# Altium schematic sheet Flow_sensor.SchDoc
size 420 x 297 mm; Address1: Address1; Address2: Address2; Address3: Address3; Address4: Address4; DocumentNumber: *Э3; SheetNumber: 12; SheetTotal: 15; DocumentType: Схема электрическая *
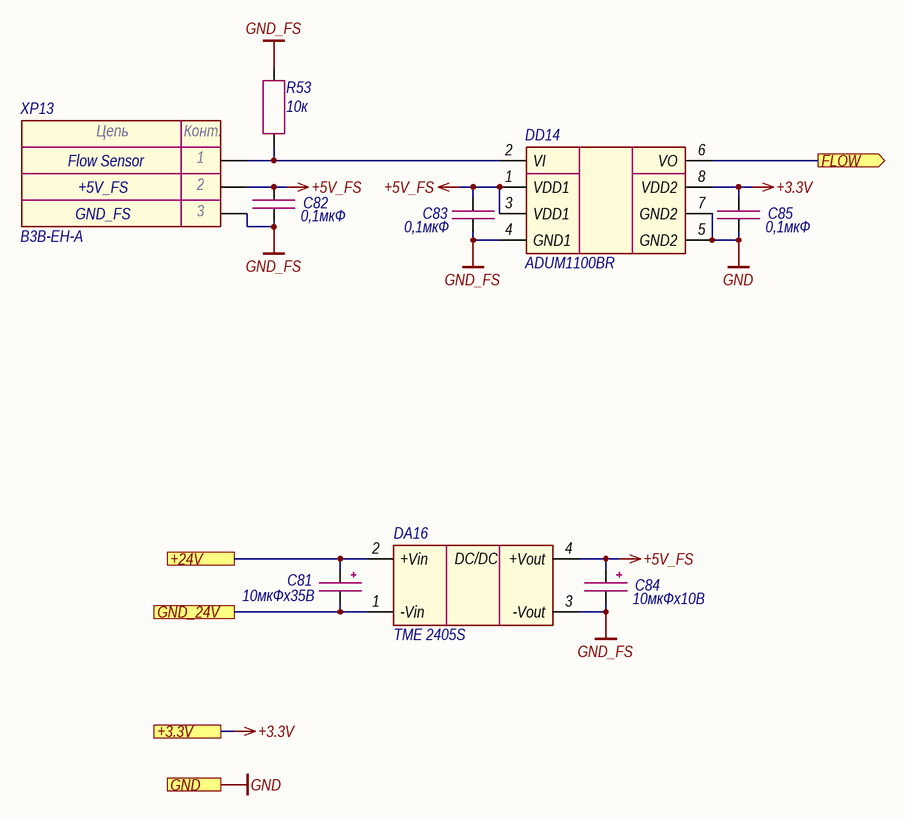
[diagram p0: Flow_sensor.SchDoc]

## Parts
C81  10мкФх35B  [CAP_C]
C82  0,1мкФ  [CAP_0603]
C83  0,1мкФ  [CAP_0603]
C84  10мкФх10B  [CAP_A]
C85  0,1мкФ  [CAP_0603]
DA16  TME 2405S  [TME (SIP-4)]
DD14  ADUM1100BR  [SOIC-8]
R53  10к  [RES_0603]
XP13  B3B-EH-A  [B3B-EH-A]

## Ports
+3.3V (see Main[1C], Button[1D], Ethernet[3D], Fiber_interlock[2C], Hardwiring[3D], LD_driver[1D], Power_supply[1D], Power_supply_CAN[1D], SF_driver[2C]), +24V (see Main[1C], Button[1C], Column[1C], Hardwiring[3C], Indication[1C], LD_driver[1C], Power_supply[1D], Power_supply_CAN[1D]), FLOW (out, see Main[1C]), GND (see Main[1C], Button[1D], Column[1C], Ethernet[3D], Fiber_interlock[2C], Guide_laser[1C], Hardwiring[3D], Indication[1C], LD_driver[1D], Power_supply[1D], Power_supply_CAN[1D], SF_driver[2D]), GND_24V (see Main[1C], Button[1D], Column[1C], Hardwiring[3C], Indication[1C], LD_driver[1D], Power_supply[1D], Power_supply_CAN[1D])

## Nets
+3.3V: C85.1 DD14.8(VDD2) ; port +3.3V
+5V_FS: C82.1 C83.1 C84.1 DA16.4(+Vout) DD14.1(VDD1) DD14.3(VDD1) XP13.2
GND: C85.2 DD14.5(GND2) DD14.7(GND2) ; port GND
GND_FS: C82.2 C83.2 C84.2 DA16.3(-Vout) DD14.4(GND1) R53.2 XP13.3
+24V: C81.1 DA16.2(+Vin) ; port +24V
FLOW: DD14.6(VO) ; port FLOW
GND_24V: C81.2 DA16.1(-Vin) ; port GND_24V
NetDD14_2: DD14.2(VI) R53.1 XP13.1

## Notes on the sheet
- +5V_FS
- Flow Sensor
- GND_FS
- Подп. и дата
- Инв. № дубл.
- Взам. инв. №
- Инв. № подл.
- Изм.
- Лист
- № докум.
- Подп.
- Дата
- Копировал
- Формат А3
- (in symbol Connector-3) Цепь; Конт.
- (in symbol TME) DC/DC

## Library data of the parts
C81 = Capacitor_Polar: Model: TECAP, 10 мкФ, 35 В, тип C, 10%; Value: 10мкФх35B; Document: *; Manufacturer: *
C82 C83 C85 = Capacitor: Manufacturer: Murata; Model: GRM188R71H104KA93D; Value: 0,1мкФ; Document: *
C84 = Capacitor_Polar: Model: TECAP, 10 мкФ, 10 В, тип A, 10%; Value: 10мкФх10B; Document: *; Manufacturer: *
DA16 = TME: Manufacturer: Traco Power; Model: TME 2405S; Document: *
DD14 = ADUM1100: Manufacturer: Analog Devices; Model: ADUM1100BR; Document: *
R53 = Resistor: Manufacturer: Yageo; Model: RC0603FR-0710KL; Value: 10к; Document: *
XP13 = Connector-3: Manufacturer: JST; Model: B3B-EH-A; Document: *